# EAGLE schematic zadaca3 (EAGLE 9.6.2)

## Sheet 1 of 2
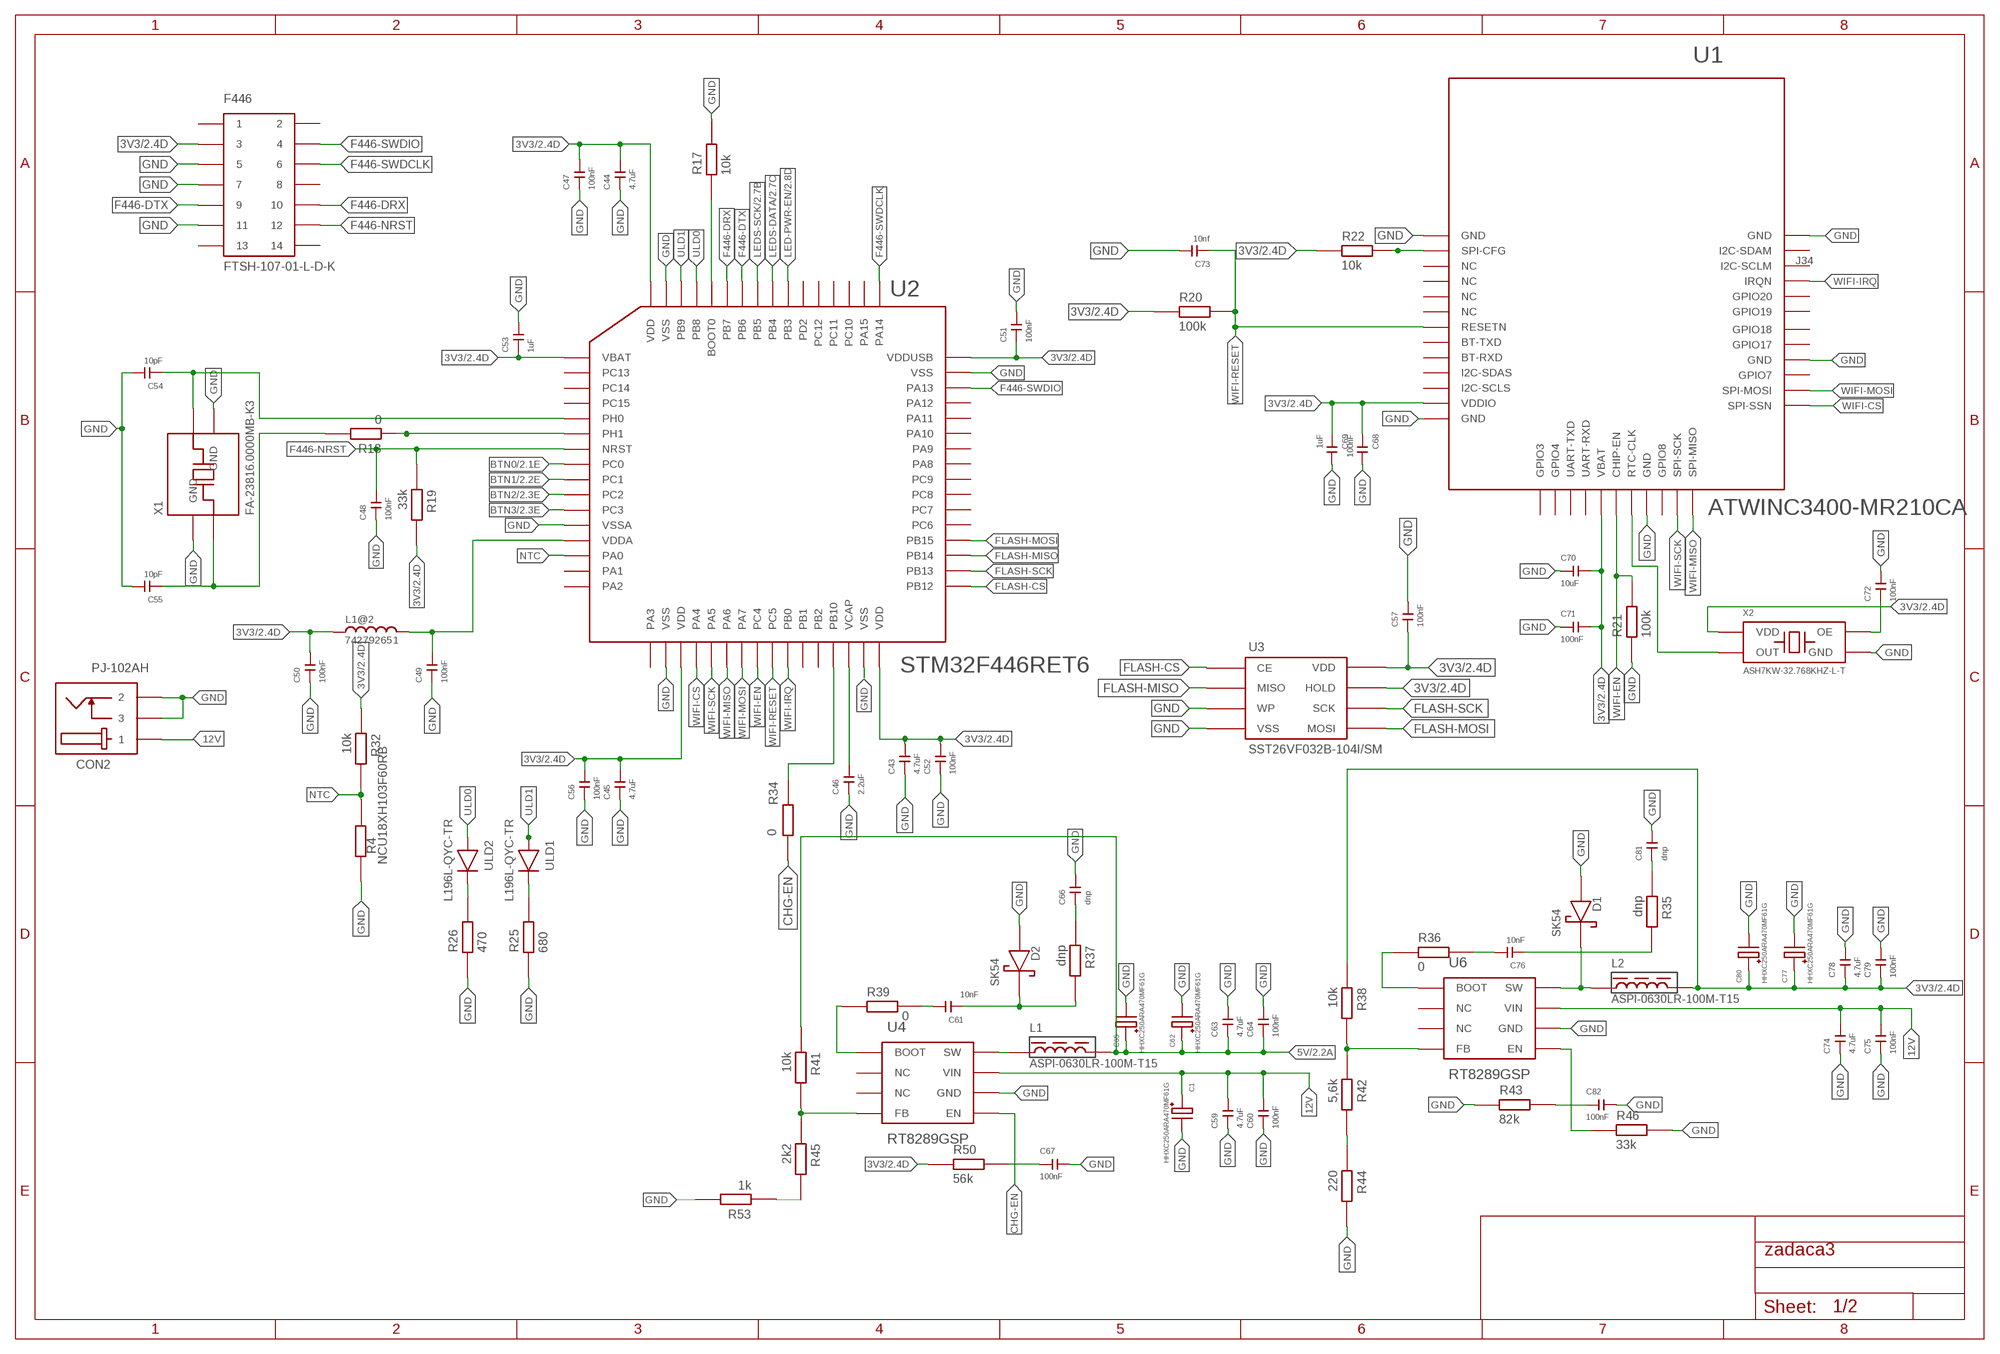
[diagram p0: schematic, sheet 1]

### Parts
C1  HHXC250ARA470MF61G  [HHXC250ARA470MF61G]
C43  4.7uF  CAPACITOR-0805-SMD  [CAPACITOR-0805-SMD]
C44  4.7uF  CAPACITOR-0805-SMD  [CAPACITOR-0805-SMD]
C45  4.7uF  CAPACITOR-0805-SMD  [CAPACITOR-0805-SMD]
C46  2.2uF  CAPACITOR-0805-SMD  [CAPACITOR-0805-SMD]
C47  100nF  CAPACITOR-0805-SMD  [CAPACITOR-0805-SMD]
C48  100nF  CAPACITOR-0805-SMD  [CAPACITOR-0805-SMD]
C49  100nF  CAPACITOR-0805-SMD  [CAPACITOR-0805-SMD]
C50  100nF  CAPACITOR-0805-SMD  [CAPACITOR-0805-SMD]
C51  100nF  CAPACITOR-0805-SMD  [CAPACITOR-0805-SMD]
C52  100nF  CAPACITOR-0805-SMD  [CAPACITOR-0805-SMD]
C53  1uF  CAPACITOR-0805-SMD  [CAPACITOR-0805-SMD]
C54  10pF  CAPACITOR-0805-SMD  [CAPACITOR-0805-SMD]
C55  10pF  CAPACITOR-0805-SMD  [CAPACITOR-0805-SMD]
C56  100nF  CAPACITOR-0805-SMD  [CAPACITOR-0805-SMD]
C57  100nF  CAPACITOR-0805-SMD  [CAPACITOR-0805-SMD]
C59  4.7uF  CAPACITOR-0805-SMD  [CAPACITOR-0805-SMD]
C60  100nF  CAPACITOR-0805-SMD  [CAPACITOR-0805-SMD]
C61  10nF  CAPACITOR-0805-SMD  [CAPACITOR-0805-SMD]
C62  HHXC250ARA470MF61G  [HHXC250ARA470MF61G]
C63  4.7uF  CAPACITOR-0805-SMD  [CAPACITOR-0805-SMD]
C64  100nF  CAPACITOR-0805-SMD  [CAPACITOR-0805-SMD]
C65  HHXC250ARA470MF61G  [HHXC250ARA470MF61G]
C66  dnp  CAPACITOR-0805-SMD  [CAPACITOR-0805-SMD]
C67  100nF  CAPACITOR-0805-SMD  [CAPACITOR-0805-SMD]
C68  100nF  CAPACITOR-0805-SMD  [CAPACITOR-0805-SMD]
C69  1uF  CAPACITOR-0805-SMD  [CAPACITOR-0805-SMD]
C70  10uF  CAPACITOR-0805-SMD  [CAPACITOR-0805-SMD]
C71  100nF  CAPACITOR-0805-SMD  [CAPACITOR-0805-SMD]
C72  100nF  CAPACITOR-0805-SMD  [CAPACITOR-0805-SMD]
C73  10nf  CAPACITOR-0805-SMD  [CAPACITOR-0805-SMD]
C74  4.7uF  CAPACITOR-0805-SMD  [CAPACITOR-0805-SMD]
C75  100nF  CAPACITOR-0805-SMD  [CAPACITOR-0805-SMD]
C76  10nF  CAPACITOR-0805-SMD  [CAPACITOR-0805-SMD]
C77  HHXC250ARA470MF61G  [HHXC250ARA470MF61G]
C78  4.7uF  CAPACITOR-0805-SMD  [CAPACITOR-0805-SMD]
C79  100nF  CAPACITOR-0805-SMD  [CAPACITOR-0805-SMD]
C80  HHXC250ARA470MF61G  [HHXC250ARA470MF61G]
C81  dnp  CAPACITOR-0805-SMD  [CAPACITOR-0805-SMD]
C82  100nF  CAPACITOR-0805-SMD  [CAPACITOR-0805-SMD]
CON2  PJ-102AH  [PJ-102AH]
D1  SK54  [SK54]
D2  SK54  [SK54]
F446  FTSH-107-01-L-D-K  [FTSH-107-01-L-D-K]
L1  ASPI-0630LR-100M-T15  [ASPI-0630LR-100M-T15]
L1@2  742792651  [742792651]
L2  ASPI-0630LR-100M-T15  [ASPI-0630LR-100M-T15]
R4  NCU18XH103F60RB  [NCU18XH103F60RB]
R17  10k  RESISTOR-0805-SMD  [RESISTOR-0805-SMD]
R18  0  RESISTOR-0805-SMD  [RESISTOR-0805-SMD]
R19  33k  RESISTOR-0805-SMD  [RESISTOR-0805-SMD]
R20  100k  RESISTOR-0805-SMD  [RESISTOR-0805-SMD]
R21  100k  RESISTOR-0805-SMD  [RESISTOR-0805-SMD]
R22  10k  RESISTOR-0805-SMD  [RESISTOR-0805-SMD]
R25  680  RESISTOR-0805-SMD  [RESISTOR-0805-SMD]
R26  470  RESISTOR-0805-SMD  [RESISTOR-0805-SMD]
R32  10k  RESISTOR-0805-SMD  [RESISTOR-0805-SMD]
R34  0  RESISTOR-0805-SMD  [RESISTOR-0805-SMD]
R35  dnp  RESISTOR-0805-SMD  [RESISTOR-0805-SMD]
R36  0  RESISTOR-0805-SMD  [RESISTOR-0805-SMD]
R37  dnp  RESISTOR-0805-SMD  [RESISTOR-0805-SMD]
R38  10k  RESISTOR-0805-SMD  [RESISTOR-0805-SMD]
R39  0  RESISTOR-0805-SMD  [RESISTOR-0805-SMD]
R41  10k  RESISTOR-0805-SMD  [RESISTOR-0805-SMD]
R42  5,6k  RESISTOR-0805-SMD  [RESISTOR-0805-SMD]
R43  82k  RESISTOR-0805-SMD  [RESISTOR-0805-SMD]
R44  220  RESISTOR-0805-SMD  [RESISTOR-0805-SMD]
R45  2k2  RESISTOR-0805-SMD  [RESISTOR-0805-SMD]
R46  33k  RESISTOR-0805-SMD  [RESISTOR-0805-SMD]
R50  56k  RESISTOR-0805-SMD  [RESISTOR-0805-SMD]
R53  1k  RESISTOR-0805-SMD  [RESISTOR-0805-SMD]
U1  ATWINC3400-MR210CA  [ATWINC3400-MR210CA]
U2  STM32F446RET6  [STM32F446RET6]
U3  SST26VF032B-104I/SM  [SST26VF032B-104I/SM]
U4  RT8289GSP  [RT8289GSP]
U6  RT8289GSP  [RT8289GSP]
ULD1  L196L-QYC-TR  [L196L-QYC-TR]
ULD2  L196L-QYC-TR  [L196L-QYC-TR]
X1  FA-23816.0000MB-K3  [FA-23816.0000MB-K3]
X2  ASH7KW-32.768KHZ-L-T  [ASH7KW-32.768KHZ-L-T]

### Nets
3V3: C43.P2 C44.P2 C45.P2 C47.P2 C50.P2 C51.P1 C52.P2 C53.P1 C56.P2 C57.P1 C68.P1 C69.P1 C70.P2 C71.P2 C77.2(P1) C78.P1 C79.P1 C80.2(P1) F446.3 L1@2.P1 L2.2 R19.P2 R20.P1 R22.P1 R32.P1 R38.P1 R50.P1 U1.J12(VDDIO) U1.J18(VBAT) U2.1(VBAT) U2.19(VDD) U2.32(VDD) U2.48(VDD) U2.64(VDDUSB) U3.7(HOLD) U3.8(VDD) X2.4(VDD) ; also sheet 2
5V: C62.2(P1) C63.P1 C64.P1 C65.2(P1) L1.2 R41.P1 ; also sheet 2
12V: C1.2(P1) C59.P2 C60.P2 C74.P2 C75.P2 CON2.1 U4.7(VIN) U6.7(VIN)
BTN0: U2.8(PC0) ; also sheet 2
BTN1: U2.9(PC1) ; also sheet 2
BTN2: U2.10(PC2) ; also sheet 2
BTN3: U2.11(PC3) ; also sheet 2
CHG-EN: R34.P1 U4.5(EN)
F446-DRX: F446.10 U2.59(PB7)
F446-DTX: F446.9 U2.58(PB6)
F446-NRST: C48.P2 F446.12 R19.P1 U2.7(NRST)
F446-SWDCLK: F446.6 U2.49(PA14)
F446-SWDIO: F446.4 U2.46(PA13)
FLASH-CS: U2.33(PB12) U3.1(CE)
FLASH-MISO: U2.35(PB14) U3.2(MISO)
FLASH-MOSI: U2.36(PB15) U3.5(MOSI)
FLASH-SCK: U2.34(PB13) U3.6(SCK)
GND: C1.1(P2) C43.P1 C44.P1 C45.P1 C46.P1 C47.P1 C48.P1 C49.P1 C50.P1 C51.P2 C52.P1 C53.P2 C54.P2 C55.P2 C56.P1 C57.P2 C59.P1 C60.P1 C62.1(P2) C63.P2 C64.P2 C65.1(P2) C66.P2 C67.P2 C68.P2 C69.P2 C70.P1 C71.P1 C72.P2 C73.P2 C74.P1 C75.P1 C77.1(P2) C78.P2 C79.P2 C80.1(P2) C81.P2 C82.P2 CON2.2 CON2.3 D1.1 D2.1 F446.5 F446.7 F446.11 R4.P1 R17.P2 R21.P1 R25.P1 R26.P1 R43.P1 R44.P2 R46.P2 R53.P2 U1.J1(GND) U1.J13(GND) U1.J21(GND) U1.J28(GND) U1.J36(GND) U2.12(VSSA) U2.18(VSS) U2.31(VSS) U2.47(VSS) U2.63(VSS) U3.3(WP) U3.4(VSS) U4.6(GND) U6.6(GND) X1.1(GND) X1.4(GND) X2.2(GND)
LED-PWR-EN: U2.55(PB3) ; also sheet 2
LEDS-DATA: U2.56(PB4) ; also sheet 2
LEDS-SCK: U2.57(PB5) ; also sheet 2
N$1: C55.P1 R18.P2 X1.2
N$2: R22.P2 U1.J2(SPI-CFG)
N$4: R18.P1 U2.6(PH1)
N$5: R34.P2 U2.29(PB10)
N$6: C46.P2 U2.30(VCAP)
N$7: C54.P1 U2.5(PH0) X1.3
N$8: C49.P2 L1@2.P2 U2.13(VDDA)
N$9: R17.P1 U2.60(BOOT0)
N$10: R46.P1 U6.5(EN)
N$11: C82.P1 R43.P2
N$12: C72.P1 X2.3(OE)
N$13: U1.J20(RTC-CLK) X2.1(OUT)
N$14: D1.2 L2.1 U6.8(SW)
N$15: C61.P1 D2.2 R37.P2
N$16: C76.P1 R35.P2
N$17: C76.P2 R36.P2
N$18: C81.P1 R35.P1
N$19: R36.P1 U6.1(BOOT)
N$20: R38.P2 R42.P1 U6.4(FB)
N$21: R42.P2 R44.P1
N$22: R26.P2 ULD2.1(P2)
N$24: R25.P2 ULD1.1(P2)
N$61: C67.P1 R50.P2
N$62: C61.P2 R39.P2
N$87: C66.P1 R37.P1
N$88: R39.P1 U4.1(BOOT)
N$89: R45.P2 R53.P1
N$90: R41.P2 R45.P1 U4.4(FB)
N$91: L1.1 U4.8(SW)
NTC: R4.P2(P22) R32.P2 U2.14(PA0)
ULD0: U2.61(PB8) ULD2.2(P1)
ULD1: U2.62(PB9) ULD1.2(P1)
WIFI-CS: U1.J25(SPI-SSN) U2.20(PA4)
WIFI-EN: R21.P2 U1.J19(CHIP-EN) U2.24(PC4)
WIFI-IRQ: U1.J33(IRQN) U2.26(PB0)
WIFI-MISO: U1.J24(SPI-MISO) U2.22(PA6)
WIFI-MOSI: U1.J26(SPI-MOSI) U2.23(PA7)
WIFI-RESET: C73.P1 R20.P2 U1.J7(RESETN) U2.25(PC5)
WIFI-SCK: U1.J23(SPI-SCK) U2.21(PA5)
Unconnected: F446.1 F446.2 F446.8 F446.13 F446.14 U1.J3(NC) U1.J4(NC) U1.J5(NC) U1.J6(NC) U1.J8(BT-TXD) U1.J9(BT-RXD) U1.J10(I2C-SDAS) U1.J11(I2C-SCLS) U1.J14(GPIO3) U1.J15(GPIO4) U1.J16(UART-TXD) U1.J17(UART-RXD) U1.J22(GPIO8) U1.J27(GPIO7) U1.J29(GPIO17) U1.J30(GPIO18) U1.J31(GPIO19) U1.J32(GPIO20) U1.J34(I2C-SCLM) U1.J35(I2C-SDAM) U2.2(PC13) U2.3(PC14) U2.4(PC15) U2.15(PA1) U2.16(PA2) U2.17(PA3) U2.27(PB1) U2.28(PB2) U2.37(PC6) U2.38(PC7) U2.39(PC8) U2.40(PC9) U2.41(PA8) U2.42(PA9) U2.43(PA10) U2.44(PA11) U2.45(PA12) U2.50(PA15) U2.51(PC10) U2.52(PC11) U2.53(PC12) U2.54(PD2) U4.2(NC) U4.3(NC) U6.2(NC) U6.3(NC)

## Sheet 2 of 2
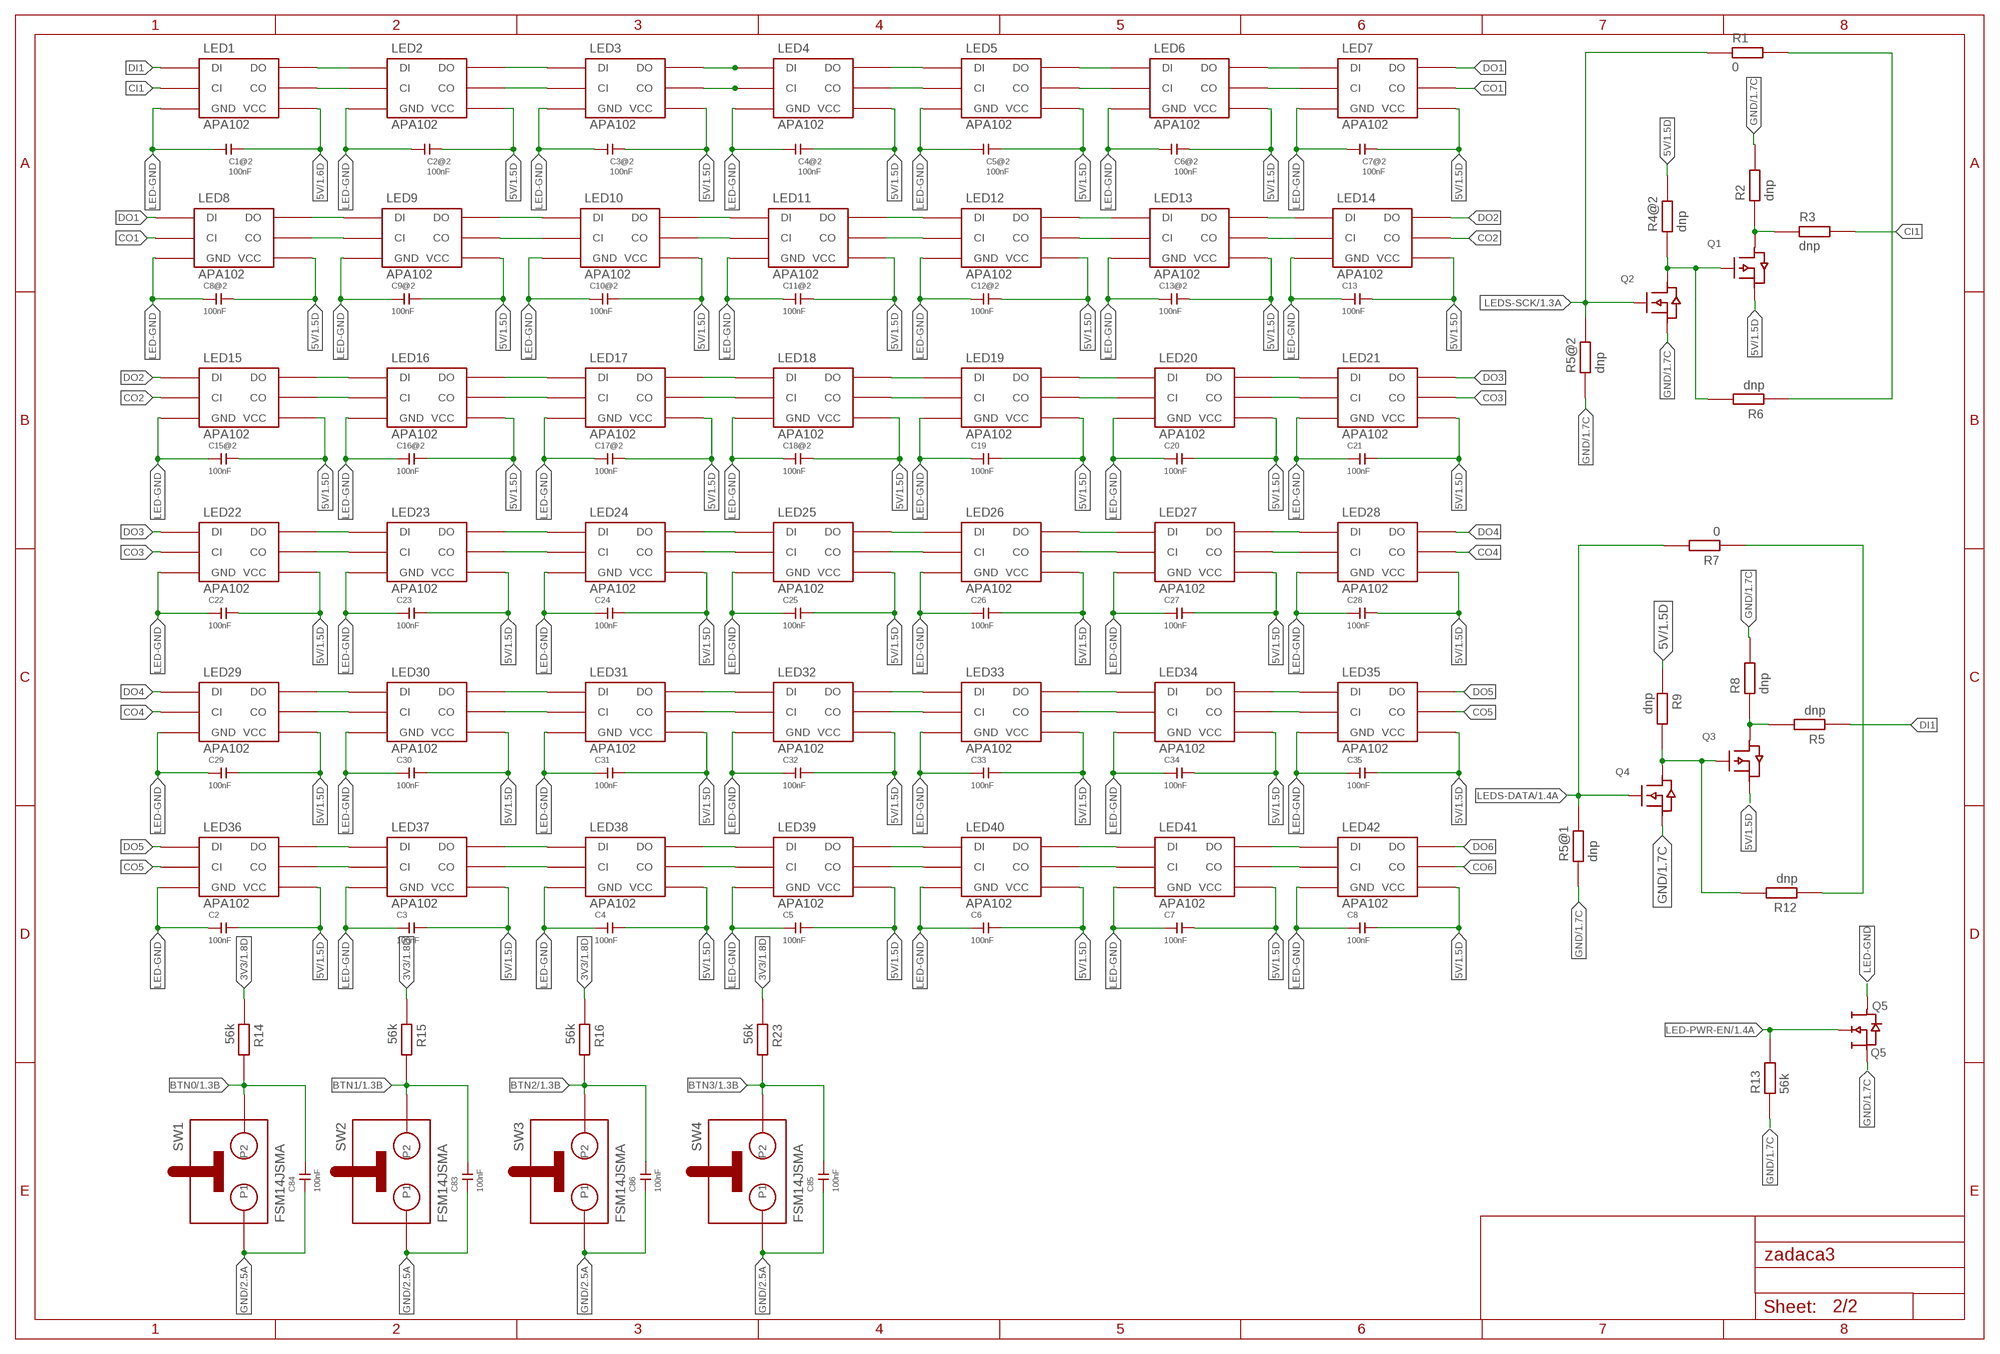
[diagram p1: schematic, sheet 2]

### Parts
C1@2  100nF  CAPACITOR-0805-SMD  [CAPACITOR-0805-SMD]
C2  100nF  CAPACITOR-0805-SMD  [CAPACITOR-0805-SMD]
C2@2  100nF  CAPACITOR-0805-SMD  [CAPACITOR-0805-SMD]
C3  100nF  CAPACITOR-0805-SMD  [CAPACITOR-0805-SMD]
C3@2  100nF  CAPACITOR-0805-SMD  [CAPACITOR-0805-SMD]
C4  100nF  CAPACITOR-0805-SMD  [CAPACITOR-0805-SMD]
C4@2  100nF  CAPACITOR-0805-SMD  [CAPACITOR-0805-SMD]
C5  100nF  CAPACITOR-0805-SMD  [CAPACITOR-0805-SMD]
C5@2  100nF  CAPACITOR-0805-SMD  [CAPACITOR-0805-SMD]
C6  100nF  CAPACITOR-0805-SMD  [CAPACITOR-0805-SMD]
C6@2  100nF  CAPACITOR-0805-SMD  [CAPACITOR-0805-SMD]
C7  100nF  CAPACITOR-0805-SMD  [CAPACITOR-0805-SMD]
C7@2  100nF  CAPACITOR-0805-SMD  [CAPACITOR-0805-SMD]
C8  100nF  CAPACITOR-0805-SMD  [CAPACITOR-0805-SMD]
C8@2  100nF  CAPACITOR-0805-SMD  [CAPACITOR-0805-SMD]
C9@2  100nF  CAPACITOR-0805-SMD  [CAPACITOR-0805-SMD]
C10@2  100nF  CAPACITOR-0805-SMD  [CAPACITOR-0805-SMD]
C11@2  100nF  CAPACITOR-0805-SMD  [CAPACITOR-0805-SMD]
C12@2  100nF  CAPACITOR-0805-SMD  [CAPACITOR-0805-SMD]
C13  100nF  CAPACITOR-0805-SMD  [CAPACITOR-0805-SMD]
C13@2  100nF  CAPACITOR-0805-SMD  [CAPACITOR-0805-SMD]
C15@2  100nF  CAPACITOR-0805-SMD  [CAPACITOR-0805-SMD]
C16@2  100nF  CAPACITOR-0805-SMD  [CAPACITOR-0805-SMD]
C17@2  100nF  CAPACITOR-0805-SMD  [CAPACITOR-0805-SMD]
C18@2  100nF  CAPACITOR-0805-SMD  [CAPACITOR-0805-SMD]
C19  100nF  CAPACITOR-0805-SMD  [CAPACITOR-0805-SMD]
C20  100nF  CAPACITOR-0805-SMD  [CAPACITOR-0805-SMD]
C21  100nF  CAPACITOR-0805-SMD  [CAPACITOR-0805-SMD]
C22  100nF  CAPACITOR-0805-SMD  [CAPACITOR-0805-SMD]
C23  100nF  CAPACITOR-0805-SMD  [CAPACITOR-0805-SMD]
C24  100nF  CAPACITOR-0805-SMD  [CAPACITOR-0805-SMD]
C25  100nF  CAPACITOR-0805-SMD  [CAPACITOR-0805-SMD]
C26  100nF  CAPACITOR-0805-SMD  [CAPACITOR-0805-SMD]
C27  100nF  CAPACITOR-0805-SMD  [CAPACITOR-0805-SMD]
C28  100nF  CAPACITOR-0805-SMD  [CAPACITOR-0805-SMD]
C29  100nF  CAPACITOR-0805-SMD  [CAPACITOR-0805-SMD]
C30  100nF  CAPACITOR-0805-SMD  [CAPACITOR-0805-SMD]
C31  100nF  CAPACITOR-0805-SMD  [CAPACITOR-0805-SMD]
C32  100nF  CAPACITOR-0805-SMD  [CAPACITOR-0805-SMD]
C33  100nF  CAPACITOR-0805-SMD  [CAPACITOR-0805-SMD]
C34  100nF  CAPACITOR-0805-SMD  [CAPACITOR-0805-SMD]
C35  100nF  CAPACITOR-0805-SMD  [CAPACITOR-0805-SMD]
C83  100nF  CAPACITOR-0805-SMD  [CAPACITOR-0805-SMD]
C84  100nF  CAPACITOR-0805-SMD  [CAPACITOR-0805-SMD]
C85  100nF  CAPACITOR-0805-SMD  [CAPACITOR-0805-SMD]
C86  100nF  CAPACITOR-0805-SMD  [CAPACITOR-0805-SMD]
LED1  APA102  [APA102]
LED2  APA102  [APA102]
LED3  APA102  [APA102]
LED4  APA102  [APA102]
LED5  APA102  [APA102]
LED6  APA102  [APA102]
LED7  APA102  [APA102]
LED8  APA102  [APA102]
LED9  APA102  [APA102]
LED10  APA102  [APA102]
LED11  APA102  [APA102]
LED12  APA102  [APA102]
LED13  APA102  [APA102]
LED14  APA102  [APA102]
LED15  APA102  [APA102]
LED16  APA102  [APA102]
LED17  APA102  [APA102]
LED18  APA102  [APA102]
LED19  APA102  [APA102]
LED20  APA102  [APA102]
LED21  APA102  [APA102]
LED22  APA102  [APA102]
LED23  APA102  [APA102]
LED24  APA102  [APA102]
LED25  APA102  [APA102]
LED26  APA102  [APA102]
LED27  APA102  [APA102]
LED28  APA102  [APA102]
LED29  APA102  [APA102]
LED30  APA102  [APA102]
LED31  APA102  [APA102]
LED32  APA102  [APA102]
LED33  APA102  [APA102]
LED34  APA102  [APA102]
LED35  APA102  [APA102]
LED36  APA102  [APA102]
LED37  APA102  [APA102]
LED38  APA102  [APA102]
LED39  APA102  [APA102]
LED40  APA102  [APA102]
LED41  APA102  [APA102]
LED42  APA102  [APA102]
Q1  NPN  [NPN]
Q2  PNP  [PNP]
Q3  NPN  [NPN]
Q4  PNP  [PNP]
Q5  DMN6068LK3-13  [DMN6068LK3-13]
R1  0  RESISTOR-0805-SMD  [RESISTOR-0805-SMD]
R2  dnp  RESISTOR-0805-SMD  [RESISTOR-0805-SMD]
R3  dnp  RESISTOR-0805-SMD  [RESISTOR-0805-SMD]
R4@2  dnp  RESISTOR-0805-SMD  [RESISTOR-0805-SMD]
R5  dnp  RESISTOR-0805-SMD  [RESISTOR-0805-SMD]
R5@1  dnp  RESISTOR-0805-SMD  [RESISTOR-0805-SMD]
R5@2  dnp  RESISTOR-0805-SMD  [RESISTOR-0805-SMD]
R6  dnp  RESISTOR-0805-SMD  [RESISTOR-0805-SMD]
R7  0  RESISTOR-0805-SMD  [RESISTOR-0805-SMD]
R8  dnp  RESISTOR-0805-SMD  [RESISTOR-0805-SMD]
R9  dnp  RESISTOR-0805-SMD  [RESISTOR-0805-SMD]
R12  dnp  RESISTOR-0805-SMD  [RESISTOR-0805-SMD]
R13  56k  RESISTOR-0805-SMD  [RESISTOR-0805-SMD]
R14  56k  RESISTOR-0805-SMD  [RESISTOR-0805-SMD]
R15  56k  RESISTOR-0805-SMD  [RESISTOR-0805-SMD]
R16  56k  RESISTOR-0805-SMD  [RESISTOR-0805-SMD]
R23  56k  RESISTOR-0805-SMD  [RESISTOR-0805-SMD]
SW1  FSM14JSMA  [FSM14JSMAS]
SW2  FSM14JSMA  [FSM14JSMAS]
SW3  FSM14JSMA  [FSM14JSMAS]
SW4  FSM14JSMA  [FSM14JSMAS]

### Nets
3V3: R14.P1 R15.P1 R16.P1 R23.P1 ; also sheet 1
5V: C1@2.P2 LED1.5(VCC) ; also sheet 1
5V/1.5D: C2.P2 C2@2.P2 C3.P2 C3@2.P2 C4.P2 C4@2.P2 C5.P2 C5@2.P2 C6.P2 C6@2.P2 C7.P2 C7@2.P2 C8.P2 C8@2.P2 C9@2.P2 C10@2.P2 C11@2.P2 C12@2.P2 C13.P2 C13@2.P2 C15@2.P2 C16@2.P2 C17@2.P2 C18@2.P2 C19.P2 C20.P2 C21.P2 C22.P2 C23.P2 C24.P2 C25.P2 C26.P2 C27.P2 C28.P2 C29.P2 C30.P2 C31.P2 C32.P2 C33.P2 C34.P2 C35.P2 LED2.5(VCC) LED3.5(VCC) LED4.5(VCC) LED5.5(VCC) LED6.5(VCC) LED7.5(VCC) LED8.5(VCC) LED9.5(VCC) LED10.5(VCC) LED11.5(VCC) LED12.5(VCC) LED13.5(VCC) LED14.5(VCC) LED15.5(VCC) LED16.5(VCC) LED17.5(VCC) LED18.5(VCC) LED19.5(VCC) LED20.5(VCC) LED21.5(VCC) LED22.5(VCC) LED23.5(VCC) LED24.5(VCC) LED25.5(VCC) LED26.5(VCC) LED27.5(VCC) LED28.5(VCC) LED29.5(VCC) LED30.5(VCC) LED31.5(VCC) LED32.5(VCC) LED33.5(VCC) LED34.5(VCC) LED35.5(VCC) LED36.5(VCC) LED37.5(VCC) LED38.5(VCC) LED39.5(VCC) LED40.5(VCC) LED41.5(VCC) LED42.5(VCC) Q1.E(P3) Q3.E(P3) R4@2.P2 R9.P1
BTN0: C84.P2 R14.P2 SW1.1(P2) SW1.2 ; also sheet 1
BTN1: C83.P2 R15.P2 SW2.1(P2) SW2.2 ; also sheet 1
BTN2: C86.P2 R16.P2 SW3.1(P2) SW3.2 ; also sheet 1
BTN3: C85.P2 R23.P2 SW4.1(P2) SW4.2 ; also sheet 1
CI1: LED1.3(CI) R3.P2
CO1: LED7.6(CO) LED8.3(CI)
CO2: LED14.6(CO) LED15.3(CI)
CO3: LED21.6(CO) LED22.3(CI)
CO4: LED28.6(CO) LED29.3(CI)
CO5: LED35.6(CO) LED36.3(CI)
CO6: LED42.6(CO)
DI1: LED1.1(DI) R5.P1
DO1: LED7.2(DO) LED8.1(DI)
DO2: LED14.2(DO) LED15.1(DI)
DO3: LED21.2(DO) LED22.1(DI)
DO4: LED28.2(DO) LED29.1(DI)
DO5: LED35.2(DO) LED36.1(DI)
DO6: LED42.2(DO)
GND/1.7C: Q2.E(P3) Q4.E(P3) Q5.3(P2) R2.P2 R5@1.P1 R5@2.P1 R8.P2 R13.P1
GND/2.5A: C83.P1 C84.P1 C85.P1 C86.P1 SW1.3(P1) SW1.4(P1) SW2.3(P1) SW2.4(P1) SW3.3(P1) SW3.4(P1) SW4.3(P1) SW4.4(P1)
LED-GND: C1@2.P1 C2.P1 C2@2.P1 C3.P1 C3@2.P1 C4.P1 C4@2.P1 C5.P1 C5@2.P1 C6.P1 C6@2.P1 C7.P1 C7@2.P1 C8.P1 C8@2.P1 C9@2.P1 C10@2.P1 C11@2.P1 C12@2.P1 C13.P1 C13@2.P1 C15@2.P1 C16@2.P1 C17@2.P1 C18@2.P1 C19.P1 C20.P1 C21.P1 C22.P1 C23.P1 C24.P1 C25.P1 C26.P1 C27.P1 C28.P1 C29.P1 C30.P1 C31.P1 C32.P1 C33.P1 C34.P1 C35.P1 LED1.4(GND) LED2.4(GND) LED3.4(GND) LED4.4(GND) LED5.4(GND) LED6.4(GND) LED7.4(GND) LED8.4(GND) LED9.4(GND) LED10.4(GND) LED11.4(GND) LED12.4(GND) LED13.4(GND) LED14.4(GND) LED15.4(GND) LED16.4(GND) LED17.4(GND) LED18.4(GND) LED19.4(GND) LED20.4(GND) LED21.4(GND) LED22.4(GND) LED23.4(GND) LED24.4(GND) LED25.4(GND) LED26.4(GND) LED27.4(GND) LED28.4(GND) LED29.4(GND) LED30.4(GND) LED31.4(GND) LED32.4(GND) LED33.4(GND) LED34.4(GND) LED35.4(GND) LED36.4(GND) LED37.4(GND) LED38.4(GND) LED39.4(GND) LED40.4(GND) LED41.4(GND) LED42.4(GND) Q5.1
LED-PWR-EN: Q5.2(P3) R13.P2 ; also sheet 1
LEDS-DATA: Q4.B(P2) R5@1.P2 R7.P2 ; also sheet 1
LEDS-SCK: Q2.B(P2) R1.P1 R5@2.P2 ; also sheet 1
N$23: R1.P2 R6.P1
N$25: LED1.2(DO) LED2.1(DI)
N$26: LED1.6(CO) LED2.3(CI)
N$27: LED2.2(DO) LED3.1(DI)
N$28: LED2.6(CO) LED3.3(CI)
N$29: LED5.2(DO) LED6.1(DI)
N$30: LED3.6(CO) LED4.3(CI)
N$31: LED3.2(DO) LED4.1(DI)
N$32: LED5.6(CO) LED6.3(CI)
N$33: LED4.6(CO) LED5.3(CI)
N$34: LED4.2(DO) LED5.1(DI)
N$35: LED6.2(DO) LED7.1(DI)
N$36: LED6.6(CO) LED7.3(CI)
N$37: LED12.2(DO) LED13.1(DI)
N$38: LED9.6(CO) LED10.3(CI)
N$39: LED9.2(DO) LED10.1(DI)
N$40: LED8.2(DO) LED9.1(DI)
N$41: LED8.6(CO) LED9.3(CI)
N$42: LED10.6(CO) LED11.3(CI)
N$43: LED10.2(DO) LED11.1(DI)
N$44: LED11.2(DO) LED12.1(DI)
N$45: LED11.6(CO) LED12.3(CI)
N$46: LED12.6(CO) LED13.3(CI)
N$47: LED13.2(DO) LED14.1(DI)
N$48: LED13.6(CO) LED14.3(CI)
N$49: LED16.2(DO) LED17.1(DI)
N$50: LED16.6(CO) LED17.3(CI)
N$51: LED18.2(DO) LED19.1(DI)
N$52: LED18.6(CO) LED19.3(CI)
N$53: LED15.6(CO) LED16.3(CI)
N$54: LED15.2(DO) LED16.1(DI)
N$55: LED17.6(CO) LED18.3(CI)
N$56: LED17.2(DO) LED18.1(DI)
N$57: LED19.2(DO) LED20.1(DI)
N$58: LED19.6(CO) LED20.3(CI)
N$59: LED20.2(DO) LED21.1(DI)
N$60: LED20.6(CO) LED21.3(CI)
N$63: LED29.6(CO) LED30.3(CI)
N$64: LED29.2(DO) LED30.1(DI)
N$65: LED22.6(CO) LED23.3(CI)
N$66: LED22.2(DO) LED23.1(DI)
N$67: LED30.2(DO) LED31.1(DI)
N$68: LED23.2(DO) LED24.1(DI)
N$69: LED23.6(CO) LED24.3(CI)
N$70: LED30.6(CO) LED31.3(CI)
N$71: LED31.2(DO) LED32.1(DI)
N$72: LED24.2(DO) LED25.1(DI)
N$73: LED24.6(CO) LED25.3(CI)
N$74: LED31.6(CO) LED32.3(CI)
N$75: LED32.2(DO) LED33.1(DI)
N$76: LED25.2(DO) LED26.1(DI)
N$77: LED25.6(CO) LED26.3(CI)
N$78: LED32.6(CO) LED33.3(CI)
N$79: LED33.2(DO) LED34.1(DI)
N$80: LED26.2(DO) LED27.1(DI)
N$81: LED26.6(CO) LED27.3(CI)
N$82: LED33.6(CO) LED34.3(CI)
N$83: LED34.2(DO) LED35.1(DI)
N$84: LED27.6(CO) LED28.3(CI)
N$85: LED27.2(DO) LED28.1(DI)
N$86: LED34.6(CO) LED35.3(CI)
N$94: Q3.C(P1) Q3.C@2(P1) R5.P2 R8.P1
N$95: Q1.C(P1) Q1.C@2(P1) R2.P1 R3.P1
N$96: Q3.B(P2) Q4.C(P1) Q4.C@2(P1) R9.P2 R12.P2
N$97: LED36.6(CO) LED37.3(CI)
N$98: R7.P1 R12.P1
N$99: LED36.2(DO) LED37.1(DI)
N$100: LED37.2(DO) LED38.1(DI)
N$101: LED37.6(CO) LED38.3(CI)
N$102: LED38.2(DO) LED39.1(DI)
N$103: LED38.6(CO) LED39.3(CI)
N$104: LED39.2(DO) LED40.1(DI)
N$105: LED39.6(CO) LED40.3(CI)
N$106: LED40.2(DO) LED41.1(DI)
N$107: LED40.6(CO) LED41.3(CI)
N$108: LED41.2(DO) LED42.1(DI)
N$109: LED41.6(CO) LED42.3(CI)
N$110: Q1.B(P2) Q2.C(P1) Q2.C@2(P1) R4@2.P1 R6.P2

## Library data of the parts
C1 C62 C65 C77 C80 = capacitorradial:HHXC250ARA470MF61G
C1@2 C2 C2@2 C3 C3@2 C4 C4@2 C5 C5@2 C6 C6@2 C7 C7@2 C8 C8@2 C9@2 C10@2 C11@2 C12@2 C13 C13@2 C15@2 C16@2 C17@2 C18@2 C19-C35 C43-C57 C59-C61 C63 C64 C66-C76 C78 C79 C81-C86 = capacitor-smd:CAPACITOR-0805-SMD
CON2 = connector_jack:PJ-102AH
D1 D2 = diode_schottky:SK54
F446 = connector_header:FTSH-107-01-L-D-K
L1 L2 =  Inductor:ASPI-0630LR-100M-T15
L1@2 = inductorl:742792651
LED1-LED42 = led:APA102
Q1 Q3 = mosfetnpn:NPN
Q2 Q4 = mosfetpnp:PNP
Q5 = mosfet2:DMN6068LK3-13
R1-R3 R4@2 R5 R5@1 R5@2 R6-R9 R12-R23 R25 R26 R32 R34-R39 R41-R46 R50 R53 = resistor-smd:RESISTOR-0805-SMD
R4 = thermistor:NCU18XH103F60RB
SW1-SW4 = switch:FSM14JSMA
U1 = transceiver:ATWINC3400-MR210CA
U2 = icmcu:STM32F446RET6
U3 = flashmemory:SST26VF032B-104I/SM
U4 U6 = regulator:RT8289GSP
ULD1 ULD2 = ydiode:L196L-QYC-TR
X1 = crystal16.0000MHZ:FA-23816.0000MB-K3
X2 = crystal:ASH7KW-32.768KHZ-L-T